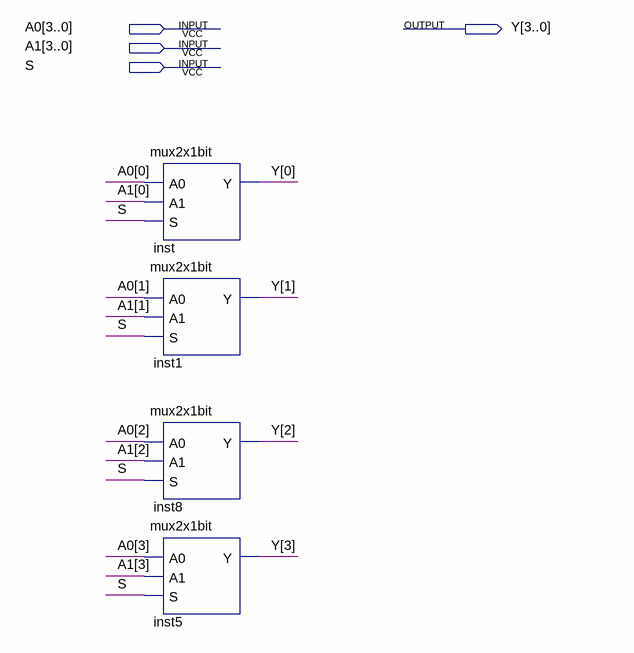
[diagram p0: schematic sheet]
// Quartus schematic mux2x4bit.bdf as structural Verilog: 4 symbols, 4 pins
module mux2x4bit (
  input  [3:0] A0,
  input  [3:0] A1,
  input  S,
  output [3:0] Y
);

  mux2x1bit inst (.A0(A0[0]), .A1(A1[0]), .S(S), .Y(Y[0]));
  mux2x1bit inst1 (.A0(A0[1]), .A1(A1[1]), .S(S), .Y(Y[1]));
  mux2x1bit inst8 (.A0(A0[2]), .A1(A1[2]), .S(S), .Y(Y[2]));
  mux2x1bit inst5 (.A0(A0[3]), .A1(A1[3]), .S(S), .Y(Y[3]));
endmodule
